# Altium schematic sheet etap2.SchDoc
size A
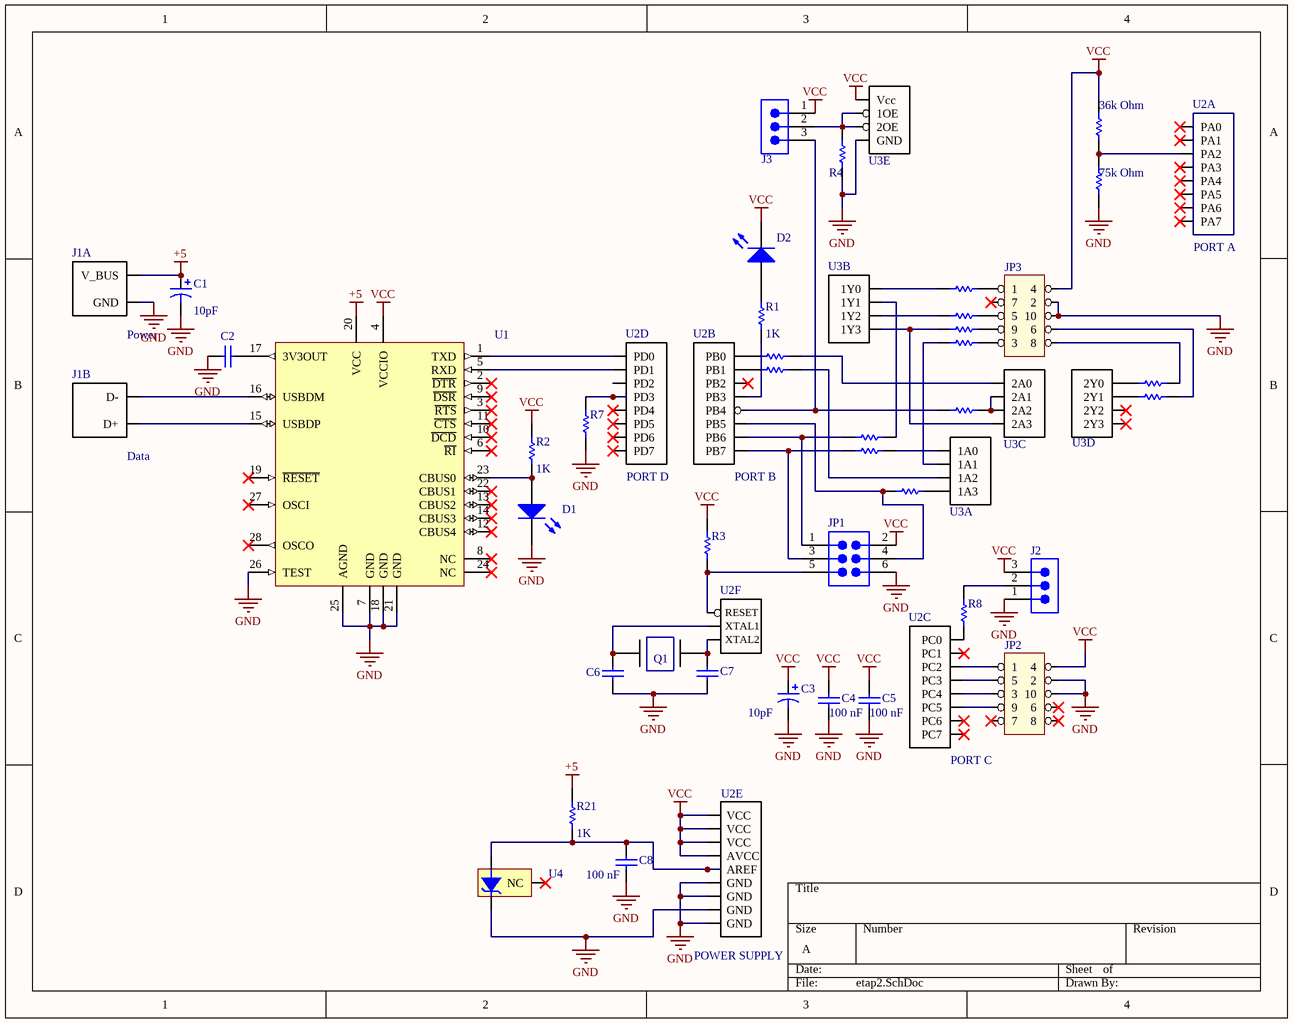
[diagram p0: etap2.SchDoc]

## Parts
C1  value 10pF  [RB7.6-15]  (hidden comment: Cap Pol1)
C2  06035C104KAT2A  [CAPC1608X90X35LL15T15]  (value not drawn)
C3  value 10pF  [RB7.6-15]  (hidden comment: Cap Pol1)
C4  Capacitance: 100 nF  [CAPC1608X90X35LL15T15]  (hidden comment: 06035C104KAT2A)
C5  Capacitance: 100 nF  [CAPC1608X90X35LL15T15]  (hidden comment: 06035C104KAT2A)
C6  CAP 22pF 50V 0402(1005)  [CAPC0402(1005)60_L]  (value not drawn)
C7  CAP 22pF 50V 0402(1005)  [CAPC0402(1005)60_L]  (value not drawn)
C8  Capacitance: 100 nF  [CAPC1608X90X35LL15T15]  (hidden comment: 06035C104KAT2A)
D1  151033YS03000  [Type 3mm]  (value not drawn)
D2  151033GS03000  [Type 3mm]  (value not drawn)
J1  USB-B-S-X-X-TH  [USB_B]  (value not drawn)  (parts A,B of 2)
J2  BG055-03-A-1-0650-0530-0350-L-B  [GCT-BG055-03-A-1-0650-0530-0350_V]  (value not drawn)
J3  BG055-03-A-1-0650-0530-0350-L-B  [GCT-BG055-03-A-1-0650-0530-0350_V]  (value not drawn)
JP1  TSW-103-08-G-D  [SMTC-TSW-103-08-X-D]  (value not drawn)
JP2  IDC male 2.54 connector  (value not drawn)
JP3  IDC male 2.54 connector  (value not drawn)
Q1  XTAL  (value not drawn)
R1  value 1K  [AXIAL-0.3]  (hidden comment: Res1)
R2  value 1K  [AXIAL-0.3]  (hidden comment: Res1)
R3  10K 1% 1812(4532)  [RESC1812(4532)_L]  (value not drawn)
R4  10K 1% 1812(4532)  [RESC1812(4532)_L]  (value not drawn)
R5  value 36k Ohm  [RESC0201(0603)_L]  (hidden comment: 36K 5% 0201(0603))
R6  value 75k Ohm  [RESC2010(5025)_M]  (hidden comment: 75K 1% 2010(5025))
R7  10K 1% 1812(4532)  [RESC1812(4532)_L]  (value not drawn)
R8  Res1  [AXIAL-0.3]  (value not drawn)
R9  Res1  [AXIAL-0.3]  (value not drawn)
R10  Res1  [AXIAL-0.3]  (value not drawn)
R11  Res1  [AXIAL-0.3]  (value not drawn)
R12  Res1  [AXIAL-0.3]  (value not drawn)
R13  Res1  [AXIAL-0.3]  (value not drawn)
R14  Res1  [AXIAL-0.3]  (value not drawn)
R15  Res1  [AXIAL-0.3]  (value not drawn)
R16  100R 1% 2512(6432)  [RESC2512(6432)_N]  (value not drawn)
R17  100R 1% 2512(6432)  [RESC2512(6432)_N]  (value not drawn)
R18  100R 1% 2512(6432)  [RESC2512(6432)_N]  (value not drawn)
R19  Res1  [AXIAL-0.3]  (value not drawn)
R20  Res1  [AXIAL-0.3]  (value not drawn)
R21  value 1K  [AXIAL-0.3]  (hidden comment: Res1)
U1  FT232RL-Reel  [SSOP-28_L]  (value not drawn)
U2  Microcontroller  [TQFP44]  (value not drawn)  (parts A,B,C,D,E,F of 6)
U3  Octal buffer-line driver  (value not drawn)  (parts A,B,C,D,E of 5)
U4  LM385BYZ-2.5  [Z03A]  (value not drawn)

## Nets
+5: C1.1 J1.1(V_BUS) R21.2 U1.20(VCC)
GND: C1.2 C2.2 C3.2 C4.1 C5.1 C6.1 C7.1 C8.1 D1.1(K) J1.4(GND) J2.1 JP1.6 JP2.2 JP2.10 JP3.2 JP3.10 R4.1 R6.1 R7.1 U1.7(GND) U1.18(GND) U1.21(GND) U1.25(AGND) U1.26(TEST) U2.6(GND) U2.18(GND) U2.28(GND) U2.39(GND) U3.10(GND) U4.2(+V)
VCC: C3.1 C4.2 C5.2 D2.1(K) J2.3 J3.1 JP1.2 JP2.4 JP3.4 R2.2 R3.2 R5.2 U1.4(VCCIO) U2.5(VCC) U2.17(VCC) U2.27(AVCC) U2.38(VCC) U3.20(Vcc)
NetC2_1: C2.1 U1.17(3V3OUT)
NetC6_2: C6.2 Q1.1 U2.8(XTAL1)
NetC7_2: C7.2 Q1.2 U2.7(XTAL2)
NetC8_2: C8.2 R21.1 U2.29(AREF) U4.3(-V)
NetD1_2: D1.2(A) R2.1 U1.23(CBUS0)
NetD2_2: D2.2(A) R1.2
NetJ1_2: J1.2(D-) U1.16(USBDM)
NetJ1_3: J1.3(D+) U1.15(USBDP)
NetJ2_2: J2.2 R8.2
NetJ3_2: J3.2 R4.2 U3.1(1OE) U3.19(2OE)
NetJ3_3: J3.3 R14.2 U2.44(PB4)
NetJP1_1: JP1.1 R9.2 U2.2(PB6)
NetJP1_3: JP1.3 R10.2 U2.3(PB7)
NetJP1_4: JP1.4 R12.2 U2.1(PB5)
NetJP1_5: JP1.5 R3.1 U2.4(RESET)
NetJP2_1: JP2.1 U2.21(PC2)
NetJP2_3: JP2.3 U2.23(PC4)
NetJP2_5: JP2.5 U2.22(PC3)
NetJP2_9: JP2.9 U2.24(PC5)
NetJP3_1: JP3.1 R16.2
NetJP3_3: JP3.3 R15.1
NetJP3_5: JP3.5 R17.2
NetJP3_6: JP3.6 R20.1
NetJP3_8: JP3.8 R19.2
NetJP3_9: JP3.9 R18.2
NetR1_1: R1.1 U2.43(PB3)
NetR5_1: R5.1 R6.2 U2.35(PA2)
NetR7_2: R7.2 U2.12(PD3)
NetR8_1: R8.1 U2.19(PC0)
NetR9_1: R9.1 U3.16(1Y1)
NetR10_1: R10.1 U3.2(1A0)
NetR11_1: R11.1 U3.6(1A2)
NetR11_2: R11.2 U2.41(PB1)
NetR12_1: R12.1 U3.8(1A3)
NetR13_1: R13.1 U3.17(2A0)
NetR13_2: R13.2 U2.40(PB0)
NetR14_1: R14.1 U3.13(2A2) U3.15(2A1)
NetR15_2: R15.2 U3.4(1A1)
NetR16_1: R16.1 U3.18(1Y0)
NetR17_1: R17.1 U3.14(1Y2)
NetR18_1: R18.1 U3.11(2A3) U3.12(1Y3)
NetR19_1: R19.1 U3.3(2Y0)
NetR20_2: R20.2 U3.5(2Y1)
NetU1_1: U1.1(TXD) U2.9(PD0)
NetU1_5: U1.5(RXD) U2.10(PD1)

Not connected (* = marked no-connect by the designer): JP2 6* 7* 8*; JP3 7*; U1 2(~{DTR})* 3(~{RTS})* 6(~{RI})* 8(NC)* 9(~{DSR})* 10(~{DCD})* 11(~{CTS})* 12(CBUS4)* 13(CBUS2)* 14(CBUS3)* 19(~{RESET})* 22(CBUS1)* 24(NC)* 27(OSCI)* 28(OSCO)*; U2 11(PD2) 13(PD4)* 14(PD5)* 15(PD6)* 16(PD7)* 20(PC1)* 25(PC6)* 26(PC7)* 30(PA7)* 31(PA6)* 32(PA5)* 33(PA4)* 34(PA3)* 36(PA1)* 37(PA0)* 42(PB2)*; U3 7(2Y2)* 9(2Y3)*; U4 1(NC)*

## Notes on the sheet
- (in symbol Atmega16-16AU, part A) PORT A
- (in symbol Atmega16-16AU, part B) PORT B
- (in symbol Atmega16-16AU, part C) PORT C
- (in symbol Atmega16-16AU, part D) PORT D
- (in symbol Atmega16-16AU, part E) POWER SUPPLY
- (in symbol USB-B-S-X-X-TH, part A) Power
- (in symbol USB-B-S-X-X-TH, part B) Data

## Library data of the parts
C1 C3 = Cap Pol1: Polarized Capacitor (Radial); Voltage Rating: 10V; Published: 8-Jun-2000; LatestRevisionDate: 17-Jul-2002; LatestRevisionNote: Re-released for DXP Platform.; PackageReference: RB7.6-15; Publisher: Altium Limited; PackageDescription: Polarized Capacitor (Radial); 2 Leads
C2 = CMP-2006-04389-2: Chip Capacitor, 100 nF, +/- 10%, 50 V, -55 to 125 degC, 0603 (1608 Metric), RoHS, Tape and Reel; Case\Package: 0603; Type (Capacitors): X7R; Capacitance: 100 nF; Voltage Rating: 50 V; Pins: 2; Max Operating Temperature: 125 degC; Min Operating Temperature: -55 degC; Case Code (Imperial): 0603; DatasheetVersion: 07/2016; Package Quantity: 4000; Length: 1.6 mm; REACH SVHC: No SVHC; Packaging: Tape and Reel; Case Code (Metric): 1608; Mounting Technology: Surface Mount; RoHSCompliant: true; Height: 0.9 mm; ComponentLink1URL: http://www.avx.com/; ComponentLink2URL: http://datasheets.avx.com/X7RDielectric.pdf; Mount: Surface Mount; ComponentLink2Description: Datasheet; Width: 0.81 mm; PackageReference: 0603; PackageDescription: 2-Pin Surface Mount Device, Body 1.6 x 0.81 mm; Radiation Hardening: No; ComponentLink1Description: Manufacturer URL; Voltage Rating (DC): 50 V; Tolerance: 10%
C4 C5 C8 = CMP-2006-04389-2: Chip Capacitor, 100 nF, +/- 10%, 50 V, -55 to 125 degC, 0603 (1608 Metric), RoHS, Tape and Reel; Case\Package: 0603; Type (Capacitors): X7R; Voltage Rating: 50 V; Pins: 2; Max Operating Temperature: 125 degC; Min Operating Temperature: -55 degC; Case Code (Imperial): 0603; DatasheetVersion: 07/2016; Package Quantity: 4000; Length: 1.6 mm; REACH SVHC: No SVHC; Packaging: Tape and Reel; Case Code (Metric): 1608; Mounting Technology: Surface Mount; RoHSCompliant: true; Height: 0.9 mm; ComponentLink1URL: http://www.avx.com/; ComponentLink2URL: http://datasheets.avx.com/X7RDielectric.pdf; Mount: Surface Mount; ComponentLink2Description: Datasheet; Width: 0.81 mm; PackageReference: 0603; PackageDescription: 2-Pin Surface Mount Device, Body 1.6 x 0.81 mm; Radiation Hardening: No; ComponentLink1Description: Manufacturer URL; Voltage Rating (DC): 50 V; Tolerance: 10%
C6 C7 = CMP-1034-00913-1: CAP 22pF 50V ±0.5pF 0402 (1005 Metric) Thickness 0.6mm SMD; Case-EIA: 0402; Case-Metric: 1005; Tolerance: Â±0.5pF; Technology: SMT; Rated Voltage: 50 V; Value: 22pF; Max Thickness: 0.6 mm
D1 = CMP-1489-00003-1: THT LED round mono-color waterclear, WL-TMRW, Yellow; Manufacturer: Wuerth Elektronik; ComponentLink2Description: Datasheet; ComponentLink1Description: Manufacturer URL; Emitting color: Yellow; ComponentLink2URL: http://katalog.we-online.de/pbs/datasheet/7448042001.pdfhttp://katalog.we-online.de/pbs/datasheet/7448042001.pdfhttp://katalog.we-online.de/pbs/datasheet/7448042001.pdfhttp://katalog.we-online.de/pbs/datasheet/151033YS03000.pdf; ComponentLink1URL: http://www.we-online.com; PartNumber: 151033YS03000; PackageReference: Type 3mm
D2 = CMP-1489-00001-1: THT LED round mono-color waterclear, THT WL-TMRW ,Green; Manufacturer: Wuerth Elektronik; ComponentLink2URL: http://katalog.we-online.de/pbs/datasheet/7448042001.pdfhttp://katalog.we-online.de/pbs/datasheet/7448042001.pdfhttp://katalog.we-online.de/pbs/datasheet/7448042001.pdfhttp://katalog.we-online.de/pbs/datasheet/151033GS03000.pdf; ComponentLink2Description: Datasheet; Emitting color: Green; ComponentLink1Description: Manufacturer URL; PackageReference: Type 3mm; PartNumber: 151033GS03000; ComponentLink1URL: http://www.we-online.com
J1 = USB-B-S-X-X-TH: USB-B interface; HelpURL: http://suddendocs.samtec.com/prints/usb-b-s-x-x-th-x-xx-mkt.pdf; Supplier 1: Digikey; Supplier Part Number 1: USB-B-S-F-B-SM-R-TR-ND
J2 J3 = CMP-0815-00002-1: Pin Header, Pitch 2.54 mm, 1 x 3 Positions, Straight, Mated Height 6.5 mm, Surface Mount, -40 to 105 degC, RoHS, Tape and Reel; Manufacturer: GCT; Dielectric Withstanding: 600 V AC; Insulation Resistance: 1000 MOhm Min.; Contact Resistance: 20 mOhm Max.; Current Rating: 3 A; PackageDescription: Pin Header, Pitch 2.54 mm, 1 x 3 Positions, Mated Height 6.5 mm; DatasheetVersion: Rev. G; Mounting Technology: Surface Mount; Packing: Tape and Reel; ComponentLink1Description: Manufacturer URL; ComponentLink2Description: Datasheet; ComponentLink1URL: http://www.gct.co/; RoHS: TRUE; Operating Temperature: -40 to 105 degC; Orientation: Straight; ComponentLink2URL: http://www.gct.co/pcb-board-to-board/pdf/BG055.pdf; PackageReference: BG055-03-A-1-0650-0530-0350-2; PartNumber: BG055-03-A-1-0650-0530-0350-L-B
JP1 = CMP-1024-00338-1: Manufacturer: Samtec; Pitch: 2.54 mm; ComponentLink1URL: http://www.samtec.com; ComponentLink2URL: http://www.samtec.com/documents/webfiles/pdf/TSW_TH.PDF; Temperature Range: -55 to 125 degC; RoHS: True; ComponentLink2Description: Datasheet; PackageReference: TSW-103-08-X-D; ComponentLink3Description: Package Specification; PackageDescription: .025[0.64] SQ. Post Terminal Strip Assembly; DatasheetVersion: F-214; Mounting Technology: Through-hole; ComponentLink1Description: Manufacturer URL; Orientation: Vertical; PartNumber: TSW-103-08-G-D; PackageVersion: DM, 8/1988; ComponentLink3URL: http://www.samtec.com/documents/webfiles/cpdf/TSW-XXX-XX-XXX-X-XX-XXX-MKT.pdf
JP2 = ZL231-10PG: HelpURL: http://www.tme.eu/pl/Document/a5b2714ead43607db121b5860f7e140e/ZL231.pdf; Supplier 1: TME; Supplier Part Number 1: ZL231-10PG
JP3 = ZL231-10GK: HelpURL: http://www.tme.eu/pl/Document/a5b2714ead43607db121b5860f7e140e/ZL231.pdf; Supplier 1: TME; Supplier Part Number 1: ZL231-10PG
Q1 = HC49US-FF3F18: HelpURL: http://www.tme.eu/pl/Document/6c671fc2d1c29550257ca2d207d0534f/HC49US_Series.pdf
R1 R2 R21 = Res1: Resistor; Published: 8-Jun-2000; LatestRevisionDate: 17-Jul-2002; LatestRevisionNote: Re-released for DXP Platform.; PackageReference: AXIAL-0.3; Publisher: Altium Limited; PackageDescription: Axial Device, Thru-Hole; 2 Leads; 0.3 in Pin Spacing
R3 R4 R7 = CMP-1016-00602-1: 10K 0.75W 1% 1812 (4532 Metric)  SMD; Case-EIA: 1812; Case-Metric: 4532; Value: 10000.00 Ohm; Technology: SMT; Power: 0.75 W; Tolerance: 1 %
R5 = CMP-1010-00111-1: 36K 0.05W 5% 0201 (0603 Metric)  SMD; Case-EIA: 0201; Case-Metric: 0603; Power: 0.05 W; Technology: SMT; Tolerance: 5 %
R6 = CMP-1017-00722-1: 75K 0.75W 1% 2010 (5025 Metric)  SMD; Case-Metric: 5025; Case-EIA: 2010; Tolerance: 1 %; Technology: SMT; Power: 0.75 W
R8-R15 R19 R20 = Res1: Resistor; Value: 1K; Published: 8-Jun-2000; LatestRevisionDate: 17-Jul-2002; LatestRevisionNote: Re-released for DXP Platform.; PackageReference: AXIAL-0.3; Publisher: Altium Limited; PackageDescription: Axial Device, Thru-Hole; 2 Leads; 0.3 in Pin Spacing
R16-R18 = CMP-1018-00397-1: 100R 1W 1% 2512 (6432 Metric)  SMD; Case-EIA: 2512; Value: 100.00 Ohm; Case-Metric: 6432; Power: 1 W; Technology: SMT; Tolerance: 1 %
U1 = CMP-0078-00029-3: USB UART Asynchronous Serial Data Transfer Chip, 28-pin SSOP, Tape and Reel; Manufacturer: FTDI; PackageVersion: Mar-12; PackageReference: SSOP-28; ComponentLink2Description: Datasheet; DatasheetVersion: ver 2.10, Mar-2012; PackageDescription: 28-Pin Small Outline Package 0.65 mm Pitch; ComponentLink1Description: Manufacturer URL; RevisionNote: DatasheetVersion updated to 2.10 Mar-2012; PartNumber: FT232RL-Reel; ComponentLink1URL: http://www.ftdichip.com/; ComponentLink2URL: http://www.ftdichip.com/Support/Documents/DataSheets/ICs/DS_FT232R.pdf
U2 = Atmega16-16AU: Microcontroller with 16k bytes in-system programmable flash; HelpURL: http://www.atmel.com/images/doc2466.pdf; Supplier 1: Arrow; Supplier Part Number 1: ATMEGA16-16AU
U3 = 74HC2444N: HelpURL: http://www.nxp.com/documents/data_sheet/74HC_HCT244.pdf
U4 = CMP-0074-00031-2: Micropower Voltage Reference Diode, 3-pin TO-92; Manufacturer: National Semiconductor; CompType: Voltage Reference IC; PackageTopMarking: NSXYTT*385BY*Z-2.5; PowerWise: N; RoHS: N; ComponentLink3URL: http://www.national.com/packaging/folders/z03a.html; ComponentLink3Description: Z03A Package Page; Code_JEDEC: TO-226-AA; DatasheetVersion: Jan-2008; ComponentLink2URL: http://www.national.com/pf/LM/LM385-2.5.html; RevisionNote: Component URLs added; ComponentLink1URL: http://www.national.com/ds/LM/LM385-2.5.pdf; PackageDescription: TO-92, Molded, 3 Lead; ComponentLink2Description: LM385-2.5 Web Page; PackageVersion: revG, Sep-2000; PinCount: 3; PackageReference: Z03A; ComponentLink1Description: LM385-2.5 Datasheet